# Altium schematic sheet Z_line_07.SchDoc
size A2; SheetNumber: 4; SheetTotal: 9
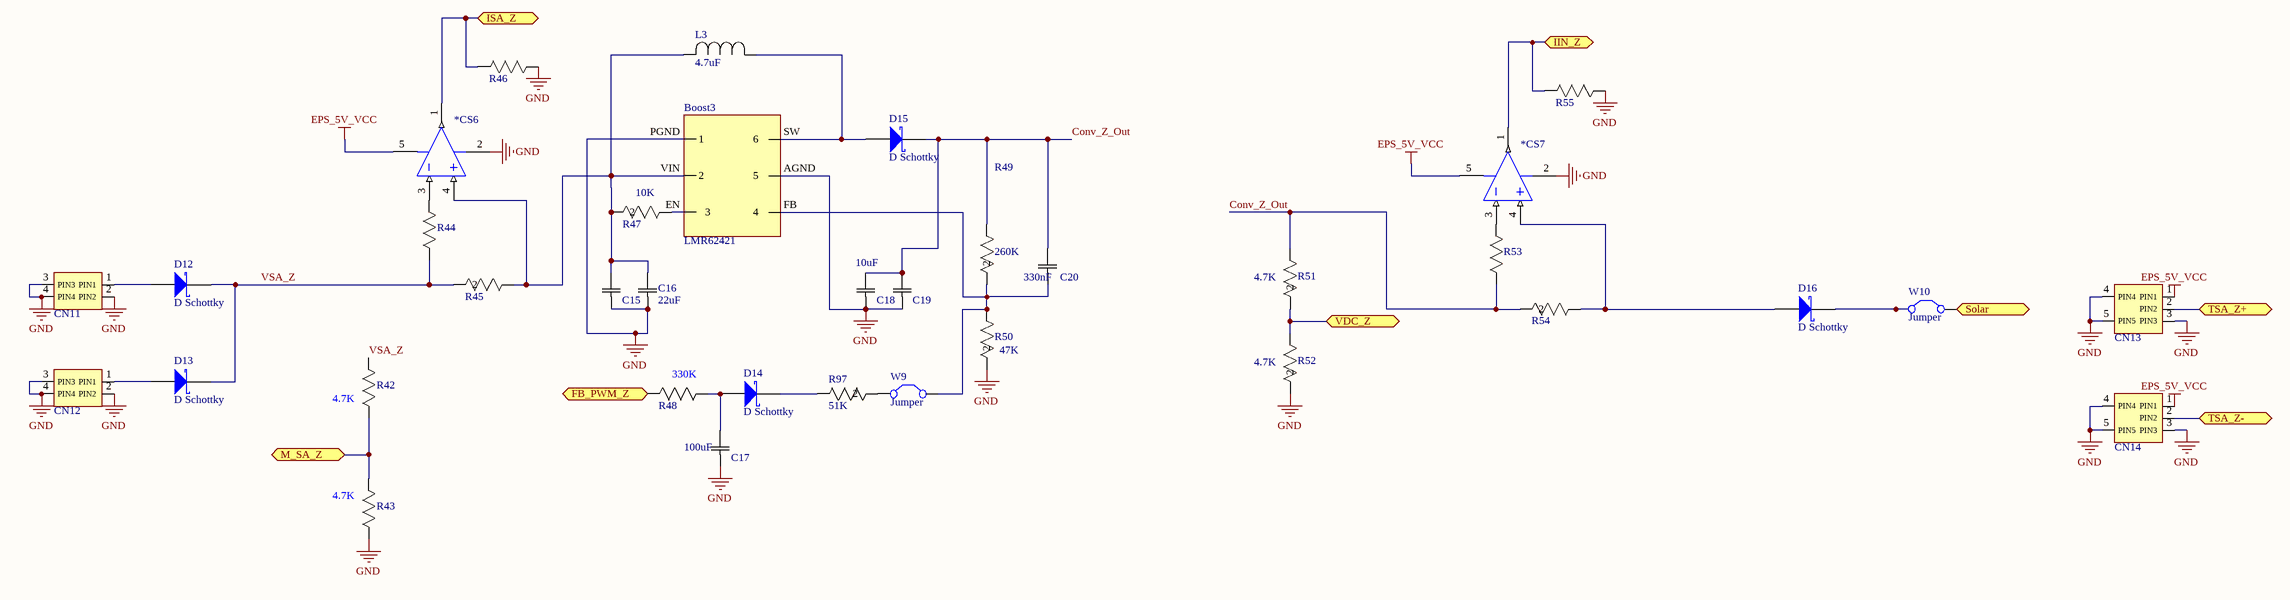
[diagram p0: Z_line_07.SchDoc]

## Parts
*CS6  CS6  [LT-S5-5-TSOT-23_N]  (value not drawn)
*CS7  CS7  [LT-S5-5-TSOT-23_N]  (value not drawn)
Boost3  LMR62421  [LMR62421]
C15  GRM155R71H103KA8  [RC0805N]  (value not drawn)
C16  22uF  [RC0805N]
C17  100uF  [RC0805N]
C18  10uF  [RC0805N]
C19  GRM155R71H103KA8  [RC0805N]  (value not drawn)
C20  330nF  [RC0805N]
CN11  SM02B-SRSS  [2pins]  (value not drawn)
CN12  SM02B-SRSS  [2pins]  (value not drawn)
CN13  SM03B-SRSS  [3pins]  (value not drawn)
CN14  SM03B-SRSS  [3pins]  (value not drawn)
D12  D Schottky  [SMB]
D13  D Schottky  [SMB]
D14  D Schottky  [SMB]
D15  D Schottky  [SMB]
D16  D Schottky  [SMB]
L3  4.7uF  [IND_SPM6530]
R42  Resistance_(Ohms): 4.7K  [RC0805N]  (hidden comment: RC0805FR)
R43  Resistance_(Ohms): 4.7K  [RC0805N]  (hidden comment: RC0805FR)
R44  RC0805FR  [RC0805N]  (value not drawn)
R45  RL0805FR-070R1L  [RC0805N]  (value not drawn)
R46  RC0805FR  [RC0805N]  (value not drawn)
R47  10K  [RC0805N]
R48  Resistance_(Ohms): 330K  [RC0805N]  (hidden comment: RC0805FR)
R49  260K  [RC0805N]
R50  47K  [RC0805N]
R51  4.7K  [RC0805N]
R52  4.7K  [RC0805N]
R53  RC0805FR  [RC0805N]  (value not drawn)
R54  RL0805FR-070R1L  [RC0805N]  (value not drawn)
R55  RC0805FR  [RC0805N]  (value not drawn)
R97  51K  [RC0805N]
W9  Jumper  [RAD-0.1]
W10  Jumper  [RAD-0.1]

## Ports
FB_PWM_Z, IIN_Z, ISA_Z, M_SA_Z, Solar, TSA_Z+, TSA_Z-, VDC_Z

## Nets
EPS_5V_VCC: *CS6.5(V+) *CS7.5(V+) CN13.1(PIN1) CN14.1(PIN1)
GND: *CS6.2(V-) *CS7.2(V-) Boost3.AGND(5) Boost3.PGND(1) C15.1 C16.1 C17.1 C18.1 C19.1 CN11.2(PIN2) CN11.3(PIN3) CN11.4(PIN4) CN12.2(PIN2) CN12.3(PIN3) CN12.4(PIN4) CN13.3(PIN3) CN13.4(PIN4) CN13.5(PIN5) CN14.3(PIN3) CN14.4(PIN4) CN14.5(PIN5) R43.2 R46.2 R50.2 R52.2 R55.2
Conv_Z_Out: C18.2 C19.2 C20.2 D15.2(K) R49.1 R51.1 R53.2 R54.2
FB_PWM_Z: R48.2 ; port FB_PWM_Z
IIN_Z: *CS7.1(OUT) R55.1 ; port IIN_Z
ISA_Z: *CS6.1(OUT) R46.1 ; port ISA_Z
M_SA_Z: R42.2 R43.1 ; port M_SA_Z
Solar: W10.2(C2) ; port Solar
TSA_Z+: CN13.2(PIN2) ; port TSA_Z+
TSA_Z-: CN14.2(PIN2) ; port TSA_Z-
VDC_Z: R51.2 R52.1 ; port VDC_Z
VSA_Z: D12.2(K) D13.2(K) R42.1 R44.2 R45.2
Net*CS6_3: *CS6.3(-IN) R44.1
Net*CS6_4: *CS6.4(+IN) Boost3.VIN(2) C15.2 C16.2 L3.2 R45.1 R47.2
Net*CS7_3: *CS7.3(-IN) R53.1
Net*CS7_4: *CS7.4(+IN) D16.1(A) R54.1
NetBoost3_EN: Boost3.EN(3) R47.1
NetBoost3_FB: Boost3.FB(4) C20.1 R49.2 R50.1 W9.2(C2)
NetBoost3_SW: Boost3.SW(6) D15.1(A) L3.1
NetC17_2: C17.2 D14.1(A) R48.1
NetCN11_1: CN11.1(PIN1) D12.1(A)
NetCN12_1: CN12.1(PIN1) D13.1(A)
NetD14_2: D14.2(K) R97.1
NetD16_2: D16.2(K) W10.1(C1)
NetR97_2: R97.2 W9.1(C1)

## Library data of the parts
*CS6 *CS7 = LT6106HS5#TRMPBF: Single Channel, Low Cost, High Side Current Sense Operational Amplifier, 0.2 MHz Typical GBW, 5-Pin SOT-23 (S5-5), High Temperature / Automotive, Pb-Free, Mini Reel; Linear Technology Part Number: LT6106; Manufacturer: Linear Technology; Channels (#): 1; GBW (MHz) Typical: 0.2; Is (mA) Typical: 0.06; Vos (mV) Guaranteed: 0.25; Vos (mV) Typical: 0.15; Vs Max (V): 36; Vs Min (V): 2.7; DatasheetVersion: Rev. A; PackageReference: LT-S5-5-TSOT-23; PackageDescription: 5-Lead Plastic TSOT-23, Body 1.63 x 2.90 mm, Pitch 0.95 mm; Supplier 1: Digi-Key; Supplier Part Number 1: LT6106HS5#TRMPBFTR-ND; Supplier 2: Digi-Key; Supplier Part Number 2: LT6106HS5#TRMPBFCT-ND; Supplier 3: Digi-Key; Supplier Part Number 3: LT6106HS5#TRMPBFDKR-ND; Supplier 4: Farnell; Supplier Part Number 4: 1663842; Supplier 5: Farnell; Supplier Part Number 5: 1663842RL; Supplier 6: Newark; Supplier Part Number 6: 57M9138; Packing: Mini Reel; RoHS: Pb-Free; Type: CSA; Mounting Technology: Surface Mount; Code_JEDEC: MO-193; PartNumber: LT6106HS5#TRMPBF; ComponentLink1Description: Manufacturer URL; ComponentLink1URL: http://www.linear.com/; ComponentLink2Description: Datasheet; ComponentLink2URL: http://cds.linear.com/docs/en/datasheet/6106fa.pdf; ComponentLink3Description: Package Specification; ComponentLink3URL: http://cds.linear.com/docs/en/packaging/SOT_5_05-08-1635.pdf
Boost3 = Component_1: LMR62421XSDDEMO: 12V @ 500mA, 2.7 ~ 5.5V in
C15 C19 = GRM155R71H103KA8: Ceramic Capacitor 0402; Manufacturer_Part_Number: GRM155R71H103KA88D; Vendor: Murata; C: Copyright (C) 2015 Accelerated Designs. All rights reserved; Copyright: Copyright (C) 2015 Accelerated Designs. All rights reserved; Value: Value; Package/Case: 0402(1005metric)
C16 C20 = GRM155R71H103KA8: Ceramic Capacitor; Manufacturer_Part_Number: GRM155R71H103KA88D; Vendor: Murata; C: Copyright (C) 2015 Accelerated Designs. All rights reserved; Copyright: Copyright (C) 2015 Accelerated Designs. All rights reserved; Value: Value; Package/Case: 0402(1005metric)
C17 C18 = GRM188R71H472KA0: Ceramic Capacitor 47uF 0603; Manufacturer_Part_Number: GRM188R71H472KA01D; Vendor: Murata; C: Copyright (C) 2015 Accelerated Designs. All rights reserved; Copyright: Copyright (C) 2015 Accelerated Designs. All rights reserved; Package/Case: 0603 (1608 Metric)
  C17: Value: 100uF
  C18: Value: Value
CN11 CN12 = 2Pin_Connector: CONN HEADER SH 2POS SIDE 1MM TIN; Manufacturer Part Number: SM02B-SRSS-TB(LF)(SN); Manufacturer: JST Sales America Inc.; Digi-Key Part Number: 455-1802-1-ND; Contact Type: Male Pin
CN13 CN14 = 3PIN_Connector: CONN HEADER SH 3POS SIDE 1MM TIN; Manufacturer Part Number: SM03B-SRSS-TB(LF)(SN); Manufacturer: JST Sales America Inc.; Digi-Key Part Number: 455-1803-1-ND; Contact Type: Male Pin; Mounting Type: Surface Mount, Right Angle
D12-D16 = D Schottky: Schottky Diode, 1A; Published: 8-Jun-2000; LatestRevisionDate: 17-Jul-2002; LatestRevisionNote: Re-released for DXP Platform.; PackageReference: SMB; Publisher: Altium Limited; PackageDescription: DO-214-AA/SMB; 2 C-Bend Leads; Body 5.3 x 3.6 mm, inc. leads (LxW); Code_JEDEC: DO-214-AA
L3 = SPM6530T-4R7M: Inductor, 4.7uH; Vendor: TDK; C: Copyright (C) 2015 Accelerated Designs. All rights reserved; Manufacturer_Part_Number: SPM6530T-4R7M; Copyright: Copyright (C) 2015 Accelerated Designs. All rights reserved; Value: Value
R42 R43 R51 R52 = RC0805FR: Thick Film Resistors 0805; Manufacturer_Part_Number: RC0805FR-074K7L; Vendor: Yageo; Resistance_In_Ohms: 4.70K; Power_(Watts): 0.125W, 1/8W; Tolerance: Â±1%; Lead_Style: Surface Mount (SMD - SMT); Voltage_-_Working: 150V; Temperature_Coefficient: Â±100ppm/Â°C; Number_of_Terminations: 2; C: Copyright (C) 2015 Accelerated Designs. All rights reserved; DigiKeyPartNumber: 311-4.70KCRTR-ND; Quantity_Available: 0; Copyright: Copyright (C) 2015 Accelerated Designs. All rights reserved; DataSheet: http://www.yageo.com/documents/recent/PYu-RC0805_51_RoHS_L_4.pdf; Case: 0805 (2012 metric); Packaging: Tape &amp; Reel (TR); Composition: Thick Film; NewarkPartNumber: 10R0398; Features: -; Package_/_Case: 0805 (2012 Metric); Size_/_Dimension: 0.079" L x 0.049" W (2.00mm x 1.25mm); Height: 0.024" (0.60mm); Value: Value
  R51 R52: Resistance_(Ohms): 4.7K
R44 R46 R47 R49 R50 R53 R55 R97 = RC0805FR: Thick Film Resistors 0805; Manufacturer_Part_Number: RC0805FR-074K7L; Vendor: Yageo; Resistance_In_Ohms: 4.70K; Power_(Watts): 0.125W, 1/8W; Tolerance: Â±1%; Lead_Style: Surface Mount (SMD - SMT); Voltage_-_Working: 150V; Temperature_Coefficient: Â±100ppm/Â°C; Resistance_(Ohms): 4.7K; Number_of_Terminations: 2; C: Copyright (C) 2015 Accelerated Designs. All rights reserved; DigiKeyPartNumber: 311-4.70KCRTR-ND; Quantity_Available: 0; Copyright: Copyright (C) 2015 Accelerated Designs. All rights reserved; DataSheet: http://www.yageo.com/documents/recent/PYu-RC0805_51_RoHS_L_4.pdf; Case: 0805 (2012 metric); Packaging: Tape &amp; Reel (TR); Composition: Thick Film; NewarkPartNumber: 10R0398; Features: -; Package_/_Case: 0805 (2012 Metric); Size_/_Dimension: 0.079" L x 0.049" W (2.00mm x 1.25mm); Height: 0.024" (0.60mm); Value: Value
R45 R54 = RL0805FR-070R1L: Sense Resistor 100m ohm 0805; Vendor: Yageo; Resistance_In_Ohms: 0.10; Power_(Watts): 0.125W, 1/8W; Tolerance: Â±1%; Lead_Style: Surface Mount (SMD - SMT); Voltage_-_Working: 300V; Temperature_Coefficient: Â±600ppm/Â°C; Resistance_(Ohms): 0.1; Number_of_Terminations: 2; C: Copyright (C) 2015 Accelerated Designs. All rights reserved; DigiKeyPartNumber: 311-.10STR-ND; Manufacturer_Part_Number: RL0805FR-070R1L; Quantity_Available: 25000; Copyright: Copyright (C) 2015 Accelerated Designs. All rights reserved; DataSheet: http://www.yageo.com/documents/recent/PYu-RL_521_RoHS_L_5.pdf; Case: 0805 (2012 metric); Packaging: Tape &amp; Reel (TR); Composition: Thick Film; NewarkPartNumber: 66R6321; Features: Current Sense; Package_/_Case: 0805 (2012 Metric); Size_/_Dimension: 0.079" L x 0.049" W (2.00mm x 1.25mm); Height: 0.024" (0.60mm); Value: Value
R48 = RC0805FR: Thick Film Resistors 0805; Manufacturer_Part_Number: RC0805FR-074K7L; Vendor: Yageo; Power_(Watts): 0.125W, 1/8W; Tolerance: Â±1%; Lead_Style: Surface Mount (SMD - SMT); Voltage_-_Working: 150V; Temperature_Coefficient: Â±100ppm/Â°C; Number_of_Terminations: 2; C: Copyright (C) 2015 Accelerated Designs. All rights reserved; DigiKeyPartNumber: 311-4.70KCRTR-ND; Quantity_Available: 0; Copyright: Copyright (C) 2015 Accelerated Designs. All rights reserved; DataSheet: http://www.yageo.com/documents/recent/PYu-RC0805_51_RoHS_L_4.pdf; Resistance_In_Ohms: 330K; Case: 0805 (2012 metric); Packaging: Tape &amp; Reel (TR); Composition: Thick Film; NewarkPartNumber: 10R0398; Features: -; Package_/_Case: 0805 (2012 Metric); Size_/_Dimension: 0.079" L x 0.049" W (2.00mm x 1.25mm); Height: 0.024" (0.60mm); Value: Value
W9 W10 = Jumper: Jumper Wire; Published: 24-Mar-1999; LatestRevisionDate: 17-Jul-2002; LatestRevisionNote: Re-released for DXP Platform.; PackageReference: RAD-0.2; Publisher: Altium Limited; PackageDescription: Radial Cap, Thru-Hole; 2 Leads; 0.2 in Pin Spacing